# Altium schematic sheet Interconnectors.SchDoc
size A4
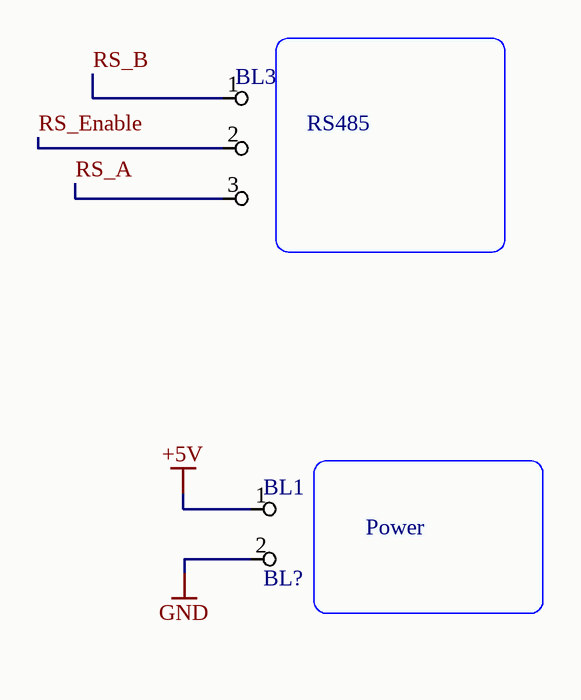
[diagram p0: Interconnectors.SchDoc]

## Parts
BL1  BL?  [2pin]
BL3  BL?  [PIN3x1]  (value not drawn)

## Nets
+5V: BL1.1
GND: BL1.2
RS_A: BL3.3
RS_B: BL3.1
RS_Enable: BL3.2

## Notes on the sheet
- (near BL3) RS485
- (near BL1) Power

## Library data of the parts
BL1 = 2.54 2pin
BL3 = 2.54 3pin